# EAGLE design stylo_buttons (EAGLE 5.10)
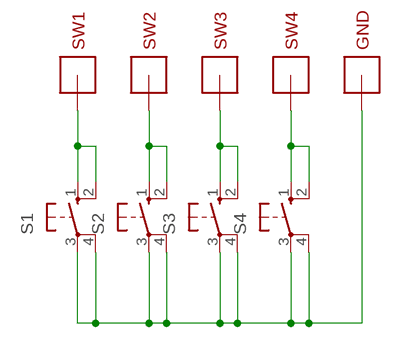
[diagram p0: schematic, sheet 1]

## Parts
GND  SMRIBBONCABLE  [SMRIBBONCABLE]
S1  10-XX  [B3F-10XX]
S2  10-XX  [B3F-10XX]
S3  10-XX  [B3F-10XX]
S4  10-XX  [B3F-10XX]
SW1  SMRIBBONCABLE  [SMRIBBONCABLE]
SW2  SMRIBBONCABLE  [SMRIBBONCABLE]
SW3  SMRIBBONCABLE  [SMRIBBONCABLE]
SW4  SMRIBBONCABLE  [SMRIBBONCABLE]

## Nets
GND: GND.1 S1.3(P) S1.4(P1) S2.3(P) S2.4(P1) S3.3(P) S3.4(P1) S4.3(P) S4.4(P1)
N$1: S1.1(S) S1.2(S1) SW1.1
N$2: S2.1(S) S2.2(S1) SW2.1
N$3: S3.1(S) S3.2(S1) SW3.1
N$4: S4.1(S) S4.2(S1) SW4.1

## Library data of the parts
GND SW1-SW4 = jasons_stuff:SMRIBBONCABLE
S1-S4 = switch-omron:10-XX: OMRON SWITCH

## Board
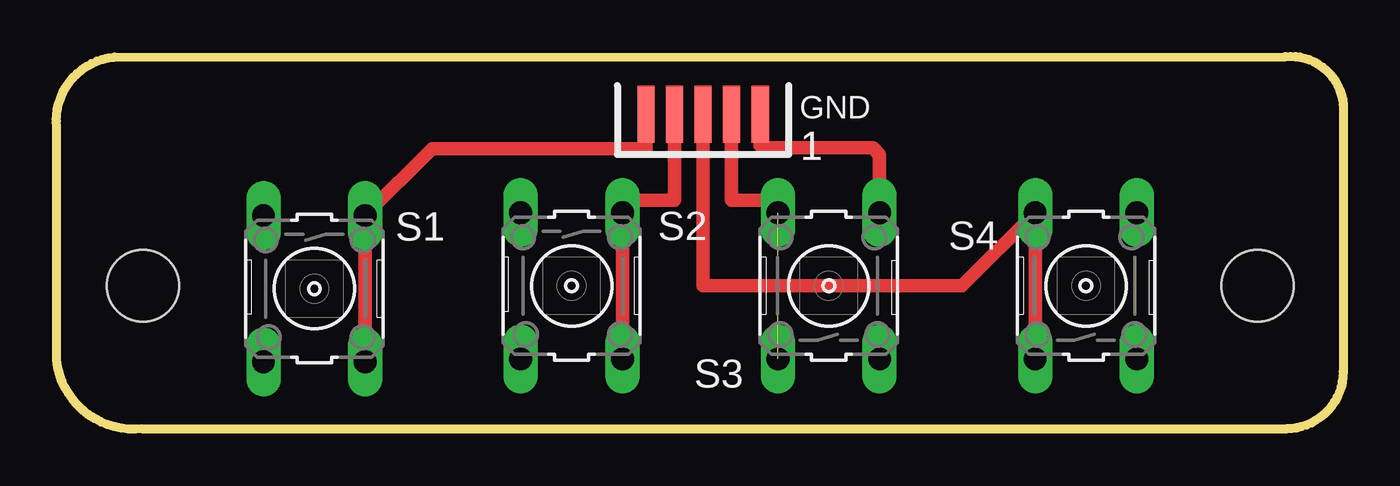
[diagram p1: board, top side]
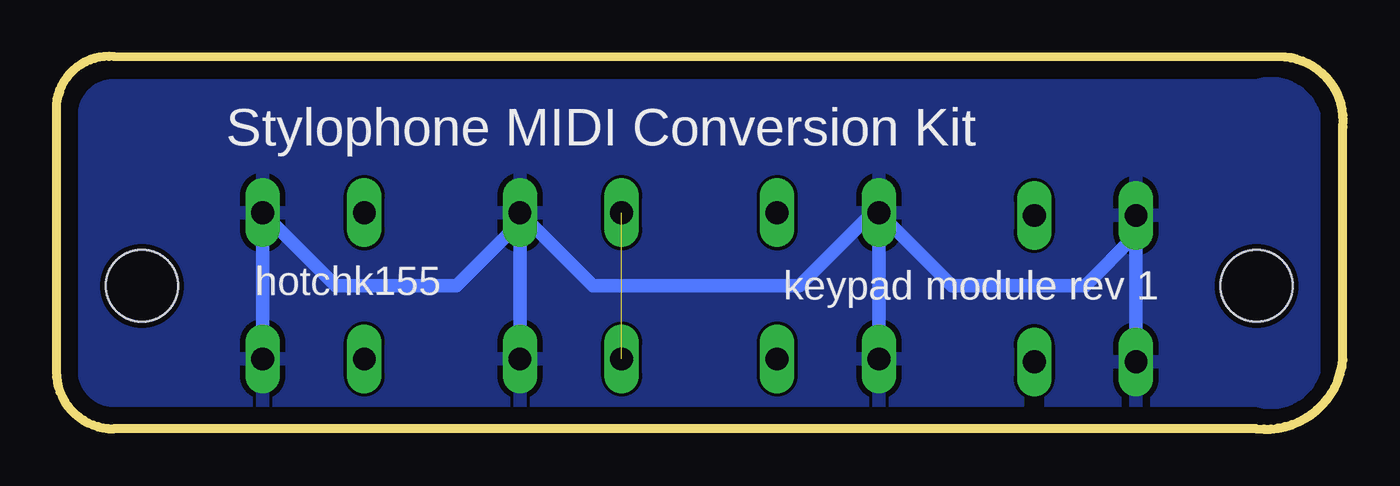
[diagram p2: board, bottom side, seen from below]

Size 57.19 x 16.57 mm. Coordinates in mm from the lower left corner, seen from the top.
Outline: 3.85,0.02 arc-90 0.01,3.07 0.01,13.43 arc-90 2.58,16.53 54.62,16.56 arc-90 57.19,14.42 57.19,2.56 arc-90 54.65,0.02 3.85,0.02
Copper layers (1*16): Top 0.035mm / dielectric 1.5mm / Bottom 0.035mm
Design rules "ITEADstudio_DRC": minimum track width 6mil, minimum drill 12mil, track to track 6mil, track to pad 6mil, pad to pad 6mil, via to via 6mil, smd to smd 0mil, copper to edge 10mil, drill to drill 10mil, minimum pad ring 10mil, minimum via ring 6mil, stop-mask expansion 2mil, vias tented up to drill 100mil, thermal gap 10mil
Holes 3.2 mm at 3.85,6.37 53.38,6.37

### Footprints (pad centres in the part's own frame; a part is rotated, then mirrored left to right if it is on the bottom)
SMRIBBONCABLE = smd 2.54 x 0.762: 1 0,0
B3F-10XX = drill 1.016 long: 1 -3.251,2.261; 2 3.251,2.261; 3 -3.251,-2.261; 4 3.251,-2.261

### Placement (x,y rotation side)
GND  31.28,13.99 90 top
S1  11.47,6.24 270 top
S2  22.9,6.37 270 top
S3  34.33,6.37 90 top
S4  45.76,6.37 90 top
SW1  26.2,13.99 90 top
SW2  27.47,13.99 90 top
SW3  30.01,13.99 90 top
SW4  28.74,13.99 90 top

### Tracks (layer width: path | path; a pad name or v marks a point on that pad's centre or on a via)
GND
  Top 0.61: GND.1 31.28,12.62 31.41,12.49 36.28,12.49 36.59,12.19 S3.4
  Bottom 0.61: S1.4 S1.3 9.21,8.63 11.47,6.37 17.39,6.37 S2.3 | S2.3 S2.4 | S4.3 S4.4 44.77,6.37 39.41,6.37 36.87,8.91 36.59,8.63 S3.3 S3.4 33.34,6.37 24.17,6.37 20.92,9.62 S2.3
  pour Bottom: 1.31,2.56 1.31,13.99 arc-90 3.85,15.26 54.65,15.26 arc-90 55.92,13.99 55.92,2.56 arc-90 54.65,1.29 3.85,1.29 arc-90
N$1
  Top 0.61: S1.2 S1.1 16.7,12.47 26.2,12.47 SW1.1
N$2
  Top 0.61: SW2.1 27.47,10.18 25.72,10.18 S2.1 S2.2
N$3  (1 unrouted)
  Top 0.61: SW3.1 30.01,10.18 31.51,10.18 S3.2
N$4
  Top 0.61: SW4.1 28.74,6.37 40.25,6.37 S4.2 S4.1

### Text on the board
tPlace: 1
bNames: Stylophone MIDI Conversion Kit | keypad module rev 1 | hotchk155